# EAGLE design CheerLightsv2 (EAGLE 8.1.1)
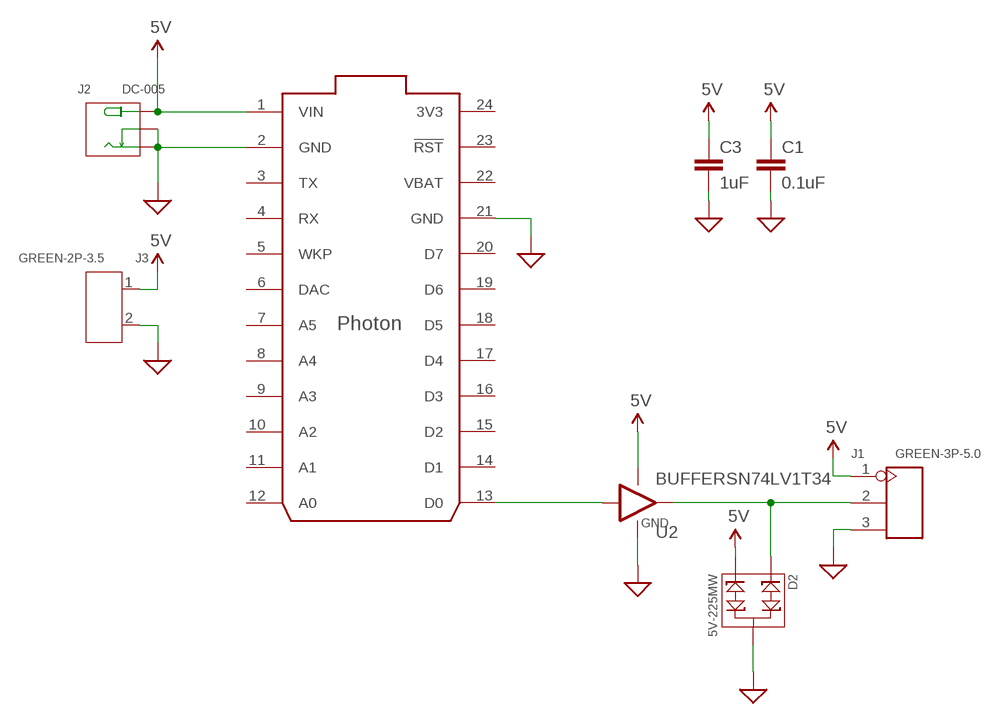
[diagram p0: schematic, sheet 1]

## Parts
C1  0.1uF  CAP0805  [0805]
C3  1uF  CAP0805  [0805]
D2  5V-225MW  SMD-DIODE-TVS-5V-225MW(SOT-23)  [SOT-23]
J1  GREEN-3P-5.0  SCREW-TERMINAL-GREEN(3P-5.0)  [H3-5.0-15.5X8.0MM]
J2  DC-005  CONN-POWER-JACK-2.1MM(DC-005)  [DCJ3P-14.2X11.0X9.0MM]
J3  GREEN-2P-3.5  SCREW-TERMINAL-GREEN(2P-3.5)  [H2-3.5-7.0X7.0MM]
U1  PHOTON_WITH_HEADERS  [PHOTON]
U2  BUFFERSN74LV1T34  [SOT23-5]

## Nets
5V [Power]: C1.1 C3.1 D2.2 J1.1 J2.+ J3.1 U1.1(VIN) U2.5(PWR)
DATA: U1.13(D0) U2.2(IN)
DOUT: D2.1 J1.2 U2.4(OUT)
GND [Power]: C1.2 C3.2 D2.3 J1.3 J2.-1(-) J2.-2(CDN) J3.2 U1.2(GND) U1.21(GND) U2.3(GND)
Unconnected: U1.3(TX) U1.4(RX) U1.5(WKP) U1.6(DAC) U1.7(A5) U1.8(A4) U1.9(A3) U1.10(A2) U1.11(A1) U1.12(A0) U1.14(D1) U1.15(D2) U1.16(D3) U1.17(D4) U1.18(D5) U1.19(D6) U1.20(D7) U1.23(!RST)

## Power pins joined to a net without a drawn wire
3V3: U1.24(3V3)
VBAT: U1.22(VBAT)

## Library data of the parts
C1 C3 = Mawrey:CAP: Capacitor Standard 0603 ceramic capacitor, and 0.1" leaded capacitor.
D2 = Seeed-Diode-2016:SMD-DIODE-TVS-5V-225MW(SOT-23): 304050003; MPN: CESD5V0AP; PARTNO: TPD2E009DBZR
J1 = Seeed-Connector -2016:SCREW-TERMINAL-GREEN(3P-5.0): 320110029; PARTNO: 1935174
J2 = Mawrey:CONN-POWER-JACK-2.1MM(DC-005): 320120003; MPN: DC-005; PARTNO: EJ508A
J3 = Seeed-Connector -2016:SCREW-TERMINAL-GREEN(2P-3.5): 320110028
U1 = Particle:PHOTON
U2 = Mawrey:BUFFER: Digi-Key Part Number 296-37176-1-ND

## Net classes
0 default: width 0.305 mm, drill 0.508 mm, clearance 0.381 mm
1 Power: width 1.422 mm, drill 0.762 mm, clearance 0.381 mm

## Board
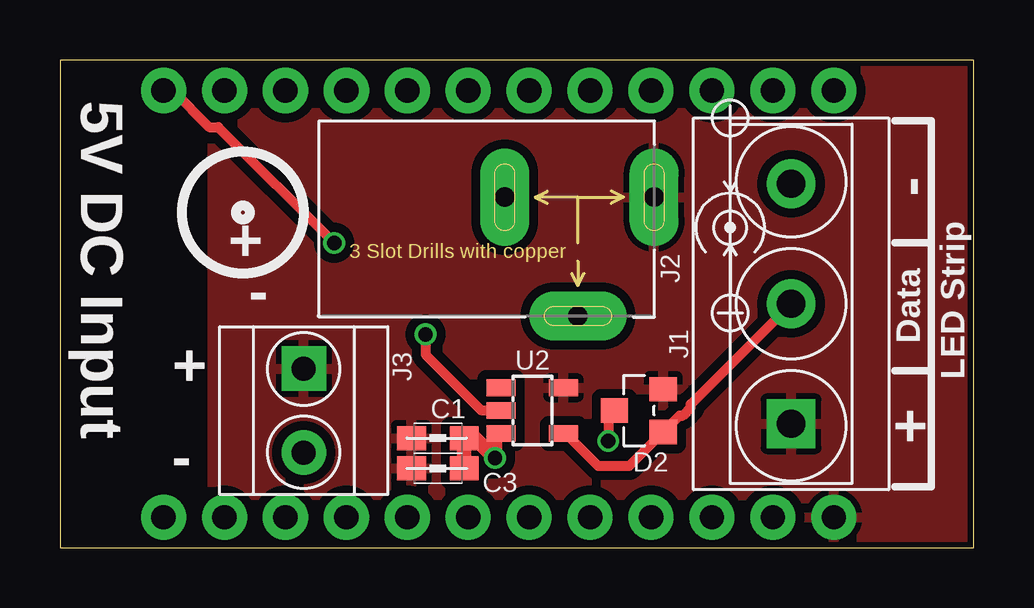
[diagram p1: board, top side]
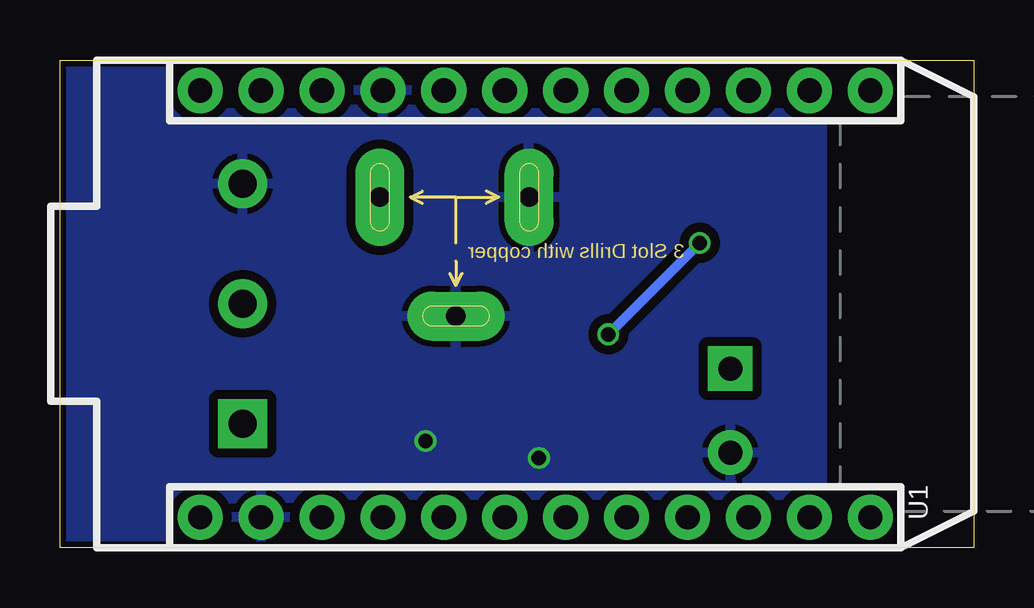
[diagram p2: board, bottom side, seen from below]

Size 38.1 x 20.32 mm. Coordinates in mm from the lower left corner, seen from the top.
Outline: 0,0 38.1,0 38.1,20.32 0,20.32 0,0
Copper layers (1*16): Top 0.035mm / dielectric 1.5mm / Bottom 0.035mm
Design rules "SeeedStudio_2layer_DRU_no_angle_20140221": minimum track width 6mil, minimum drill 12mil, track to track 6mil, track to pad 6mil, pad to pad 6mil, via to via 6mil, smd to smd 0mil, copper to edge 10mil, drill to drill 10mil, minimum pad ring 10mil, minimum via ring 6mil, stop-mask expansion 2mil, vias tented up to drill 100mil, thermal gap 10mil

### Footprints (pad centres in the part's own frame; a part is rotated, then mirrored left to right if it is on the bottom)
0805 = smd 1.2 x 1: 1 -1.1,0; 2 1.1,0
SOT-23 = smd 1.016 x 1.143: 1 -0.889,-1.016; 2 0.889,-1.016; 3 0,1.016
H3-5.0-15.5X8.0MM = drill 1.168 pad 2.032 square: 1 0,5 | drill 1.168 pad 2.032: 2 0,0; 3 0,-5
DCJ3P-14.2X11.0X9.0MM = drill 0.813 pad 2.032 long: + 3.175,0; -1 -3.048,0; -2 0,-4.953
H2-3.5-7.0X7.0MM = drill 1 pad 1.85 square: 1 -1.75,0 | drill 1 pad 1.85: 2 1.75,0
PHOTON = drill 1.016 pad 1.88: 1 1.27,32.258; 2 1.27,29.718; 3 1.27,27.178; 4 1.27,24.638; 5 1.27,22.098; 6 1.27,19.558; 7 1.27,17.018; 8 1.27,14.478; 9 1.27,11.938; 10 1.27,9.398; 11 1.27,6.858; 12 1.27,4.318; 13 19.05,4.318; 14 19.05,6.858; 15 19.05,9.398; 16 19.05,11.938; 17 19.05,14.478; 18 19.05,17.018; 19 19.05,19.558; 20 19.05,22.098; 21 19.05,24.638; 22 19.05,27.178; 23 19.05,29.718; 24 19.05,32.258
SOT23-5 = smd 0.69 x 1.2: 1 -0.95,-1.3; 2 0,-1.3; 3 0.95,-1.3; 4 0.95,1.3; 5 -0.95,1.3

### Placement (x,y rotation side)
C1  15.75,4.57 0 top
C3  15.75,3.3 0 top
D2  24.13,5.71 90 top
J1  30.48,10.16 180 top
J2  21.59,14.61 0 top
J3  10.16,5.71 270 top
U1  0,0 90 bottom
U2  19.69,5.71 270 top

### Tracks (layer width: path | path; a pad name or v marks a point on that pad's centre or on a via)
5V
  pour Top: 6.35,22.86 6.35,-2.54 40.64,-2.54 40.64,22.86
DATA  (via drill 0.6)
  Top 0.406: v11.43,12.7 6.6,17.53 6.23,17.53 4.7,19.05 U1.13 | U2.2 18.37,5.74 17.55,5.74 15.24,8.04 v15.24,8.89
  Bottom 0.406: v11.43,12.7 v15.24,8.89
DOUT
  Top 0.406: J1.2 26.3,5.98 26.3,5.85 25.96,5.51 25.83,5.51 D2.1 23.73,3.41 22.43,3.41 21.07,4.76 U2.4
GND  (via drill 0.6)
  Top 0.406: D2.3 22.86,5.46 v22.86,4.45
  Top 0.61: U2.3 18.14,4.51 v18.14,3.73 17.3,4.57 C1.2 C3.2
  pour Bottom: 6.35,21.59 6.35,-1.27 39.37,-1.27 39.37,21.59

### Text on the board
tPlace: 5V DC Input | - | + | - | Data | LED Strip | + | + | -
Document: Part x (in) y (in) Rotation / C1 0.620 0.130 0 / C3 0.620 0.180 0 / D2 0.950 0.225 90 / U2 0.775 0.225 270 / J3 0.400 0.225 270 / J2 0.850 0.575 0 / J1 1.200 0.400 180 / U1 0 0 90 (bottom)